# Altium project RX5808_BUT.PrjPcb
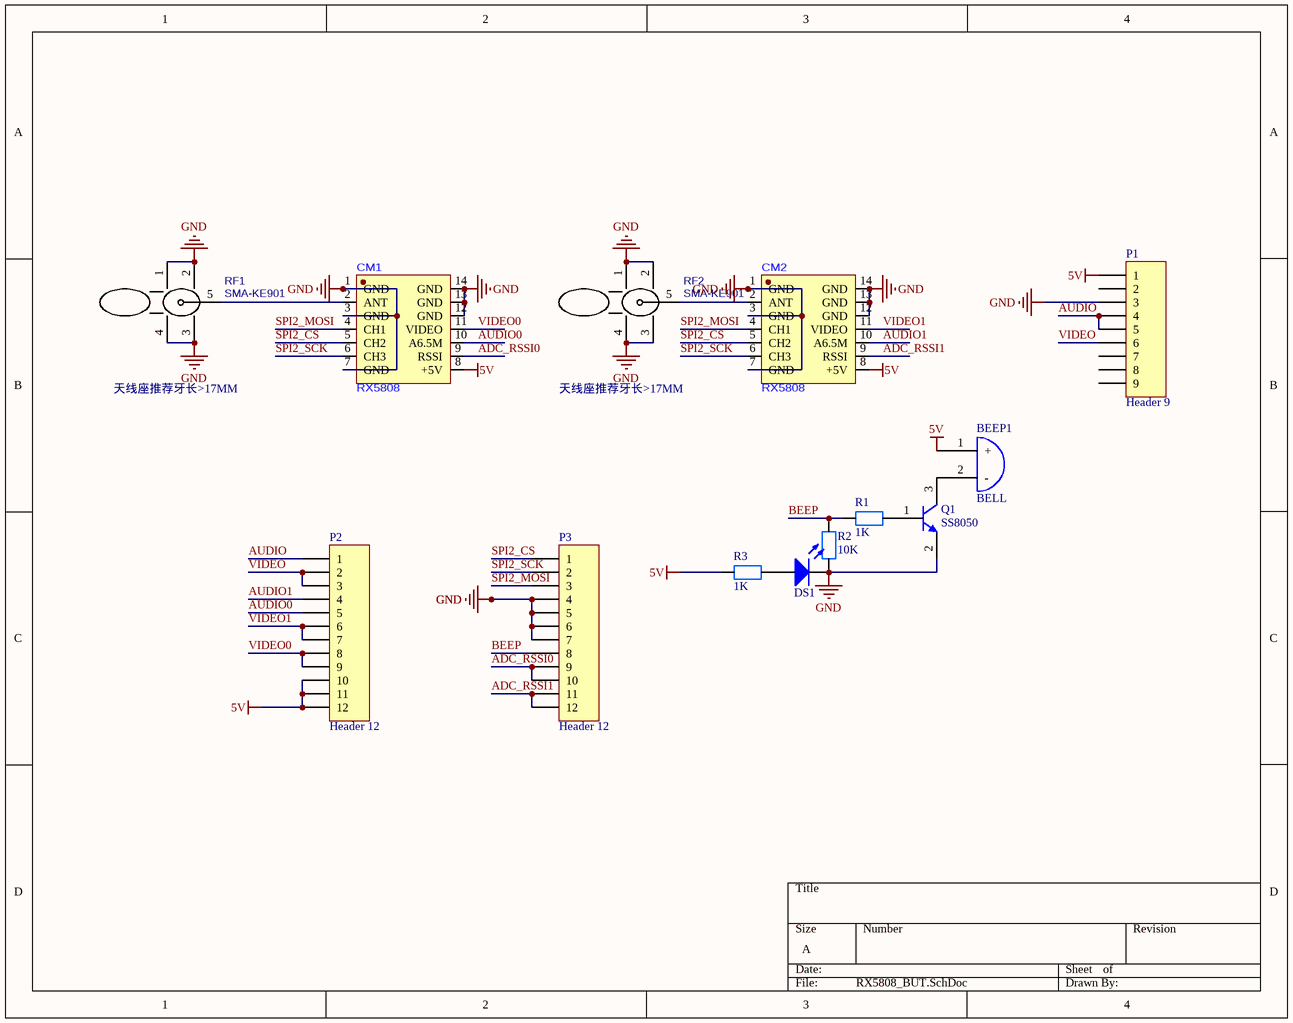
[diagram p0: RX5808_BUT.SchDoc]
1 sheet, 13 parts. Net scope: global (net labels, ports and power ports of the same name join across sheets).
Board file: RX5808_BUT.PcbDoc

## Sheet RX5808_BUT.SchDoc
size A; SheetNumber: 1; SheetTotal: 1

### Parts
BEEP1  BELL  [BEEP 5x9x5.5]
CM1  RX5808  [COMM-SMD_12P_RX5808]
CM2  RX5808  [COMM-SMD_12P_RX5808]
DS1  LED  [0402_LED]  (value not drawn)
P1  Header 9  [HDR-1X9]
P2  Header 12  [HDR1.27-1x12-M]
P3  Header 12  [HDR1.27-1x12-M]
Q1  SS8050  [SOT23A]
R1  1K  [0402_RES]
R2  10K  [0402_RES]
R3  1K  [0402_RES]
RF1  SMA-KE901  [SMA-TH_SMA-KE901]
RF2  SMA-KE901  [SMA-TH_SMA-KE901]

### Nets
5V: BEEP1.1(+) CM1.8(+5V) CM2.8(+5V) P1.1 P2.10 P2.11 P2.12 R3.1
GND: CM1.1(GND) CM1.3(GND) CM1.7(GND) CM1.12(GND) CM1.13(GND) CM1.14(GND) CM2.1(GND) CM2.3(GND) CM2.7(GND) CM2.12(GND) CM2.13(GND) CM2.14(GND) DS1.2(K) P1.3 P3.4 P3.5 P3.6 P3.7 Q1.2(E) R2.1 RF1.1 RF1.2 RF1.3 RF1.4 RF2.1 RF2.2 RF2.3 RF2.4
ADC_RSSI0: CM1.9(RSSI) P3.9 P3.10
ADC_RSSI1: CM2.9(RSSI) P3.11 P3.12
AUDIO: P1.4 P1.5 P2.1
AUDIO0: CM1.10(A6.5M) P2.5
AUDIO1: CM2.10(A6.5M) P2.4
BEEP: P3.8 R1.1 R2.2
SPI2_CS: CM1.5(CH2) CM2.5(CH2) P3.1
SPI2_MOSI: CM1.4(CH1) CM2.4(CH1) P3.3
SPI2_SCK: CM1.6(CH3) CM2.6(CH3) P3.2
VIDEO: P1.6 P2.2 P2.3
VIDEO0: CM1.11(VIDEO) P2.8 P2.9
VIDEO1: CM2.11(VIDEO) P2.6 P2.7
NetBEEP1_2: BEEP1.2(-) Q1.3(C)
NetCM1_2: CM1.2(ANT) RF1.5
NetCM2_2: CM2.2(ANT) RF2.5
NetDS1_1: DS1.1(A) R3.2
NetQ1_1: Q1.1(B) R1.2

Not connected (* = marked no-connect by the designer): P1 2 7 8 9

### Notes on the sheet
- 天线座推荐牙长>17MM

### Library data of the parts
BEEP1 = Beep: 蜂鸣器
P1 = Header 9: Header, 9-Pin; LatestRevisionDate: 17-Jul-2002; LatestRevisionNote: Re-released for DXP Platform.; Publisher: Altium Limited
P2 P3 = Header 12: Header, 12-Pin; LatestRevisionDate: 17-Jul-2002; LatestRevisionNote: Re-released for DXP Platform.; Publisher: Altium Limited
Q1 = SS8050: NPN三极管
R1-R3 = RES: 电阻
RF1 RF2 = SMA-KE901: BOM_Manufacturer: DreamLNK; Contributor: LCSC; BOM_Supplier: LCSC; BOM_Supplier Part: C914559; BOM_Manufacturer Part: SMA-KE901; BOM_JLCPCB Part Class: Extended Part; spicePre: R; spiceSymbolName: SMA-KE901